# Altium schematic sheet History.SchDoc
size 199 x 160 mm
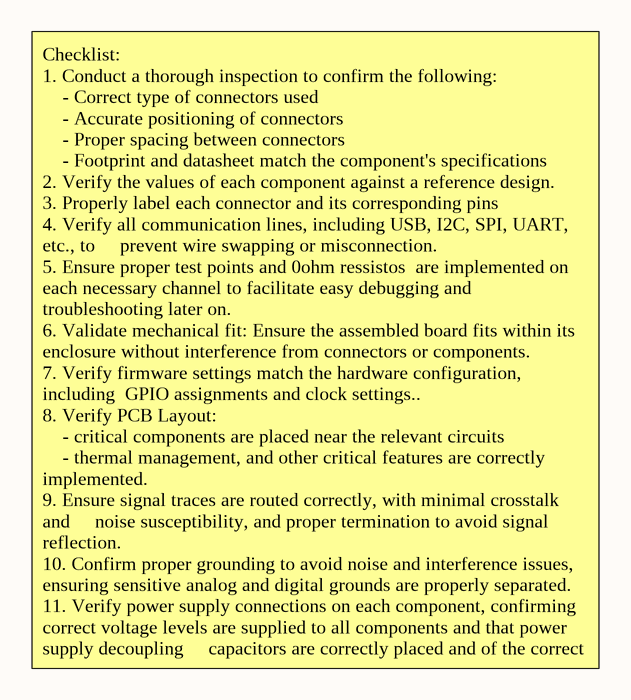
[diagram p0: History.SchDoc]

## Notes on the sheet
- Checklist:
  1. Conduct a thorough inspection to confirm the following:
  - Correct type of connectors used
  - Accurate positioning of connectors
  - Proper spacing between connectors
  - Footprint and datasheet match the component's specifications
  2. Verify the values of each component against a reference design.
  3. Properly label each connector and its corresponding pins
  4. Verify all communication lines, including USB, I2C, SPI, UART, etc., to     prevent wire swapping or misconnection.
  5. Ensure proper test points and 0ohm ressistos  are implemented on each necessary channel to facilitate easy debugging and troubleshooting later on.
  6. Validate mechanical fit: Ensure the assembled board fits within its     enclosure without interference from connectors or components.
  7. Verify firmware settings match the hardware configuration,   including  GPIO assignments and clock settings..
  8. Verify PCB Layout:
  - critical components are placed near the relevant circuits
  - thermal management, and other critical features are correctly          implemented.
  9. Ensure signal traces are routed correctly, with minimal crosstalk and     noise susceptibility, and proper termination to avoid signal reflection.
  10. Confirm proper grounding to avoid noise and interference issues,     ensuring sensitive analog and digital grounds are properly separated.
  11. Verify power supply connections on each component, confirming correct voltage levels are supplied to all components and that power supply decoupling     capacitors are correctly placed and of the correct value.